# EAGLE design emonDCduo-ESP v1.0a (EAGLE 7.7.0)
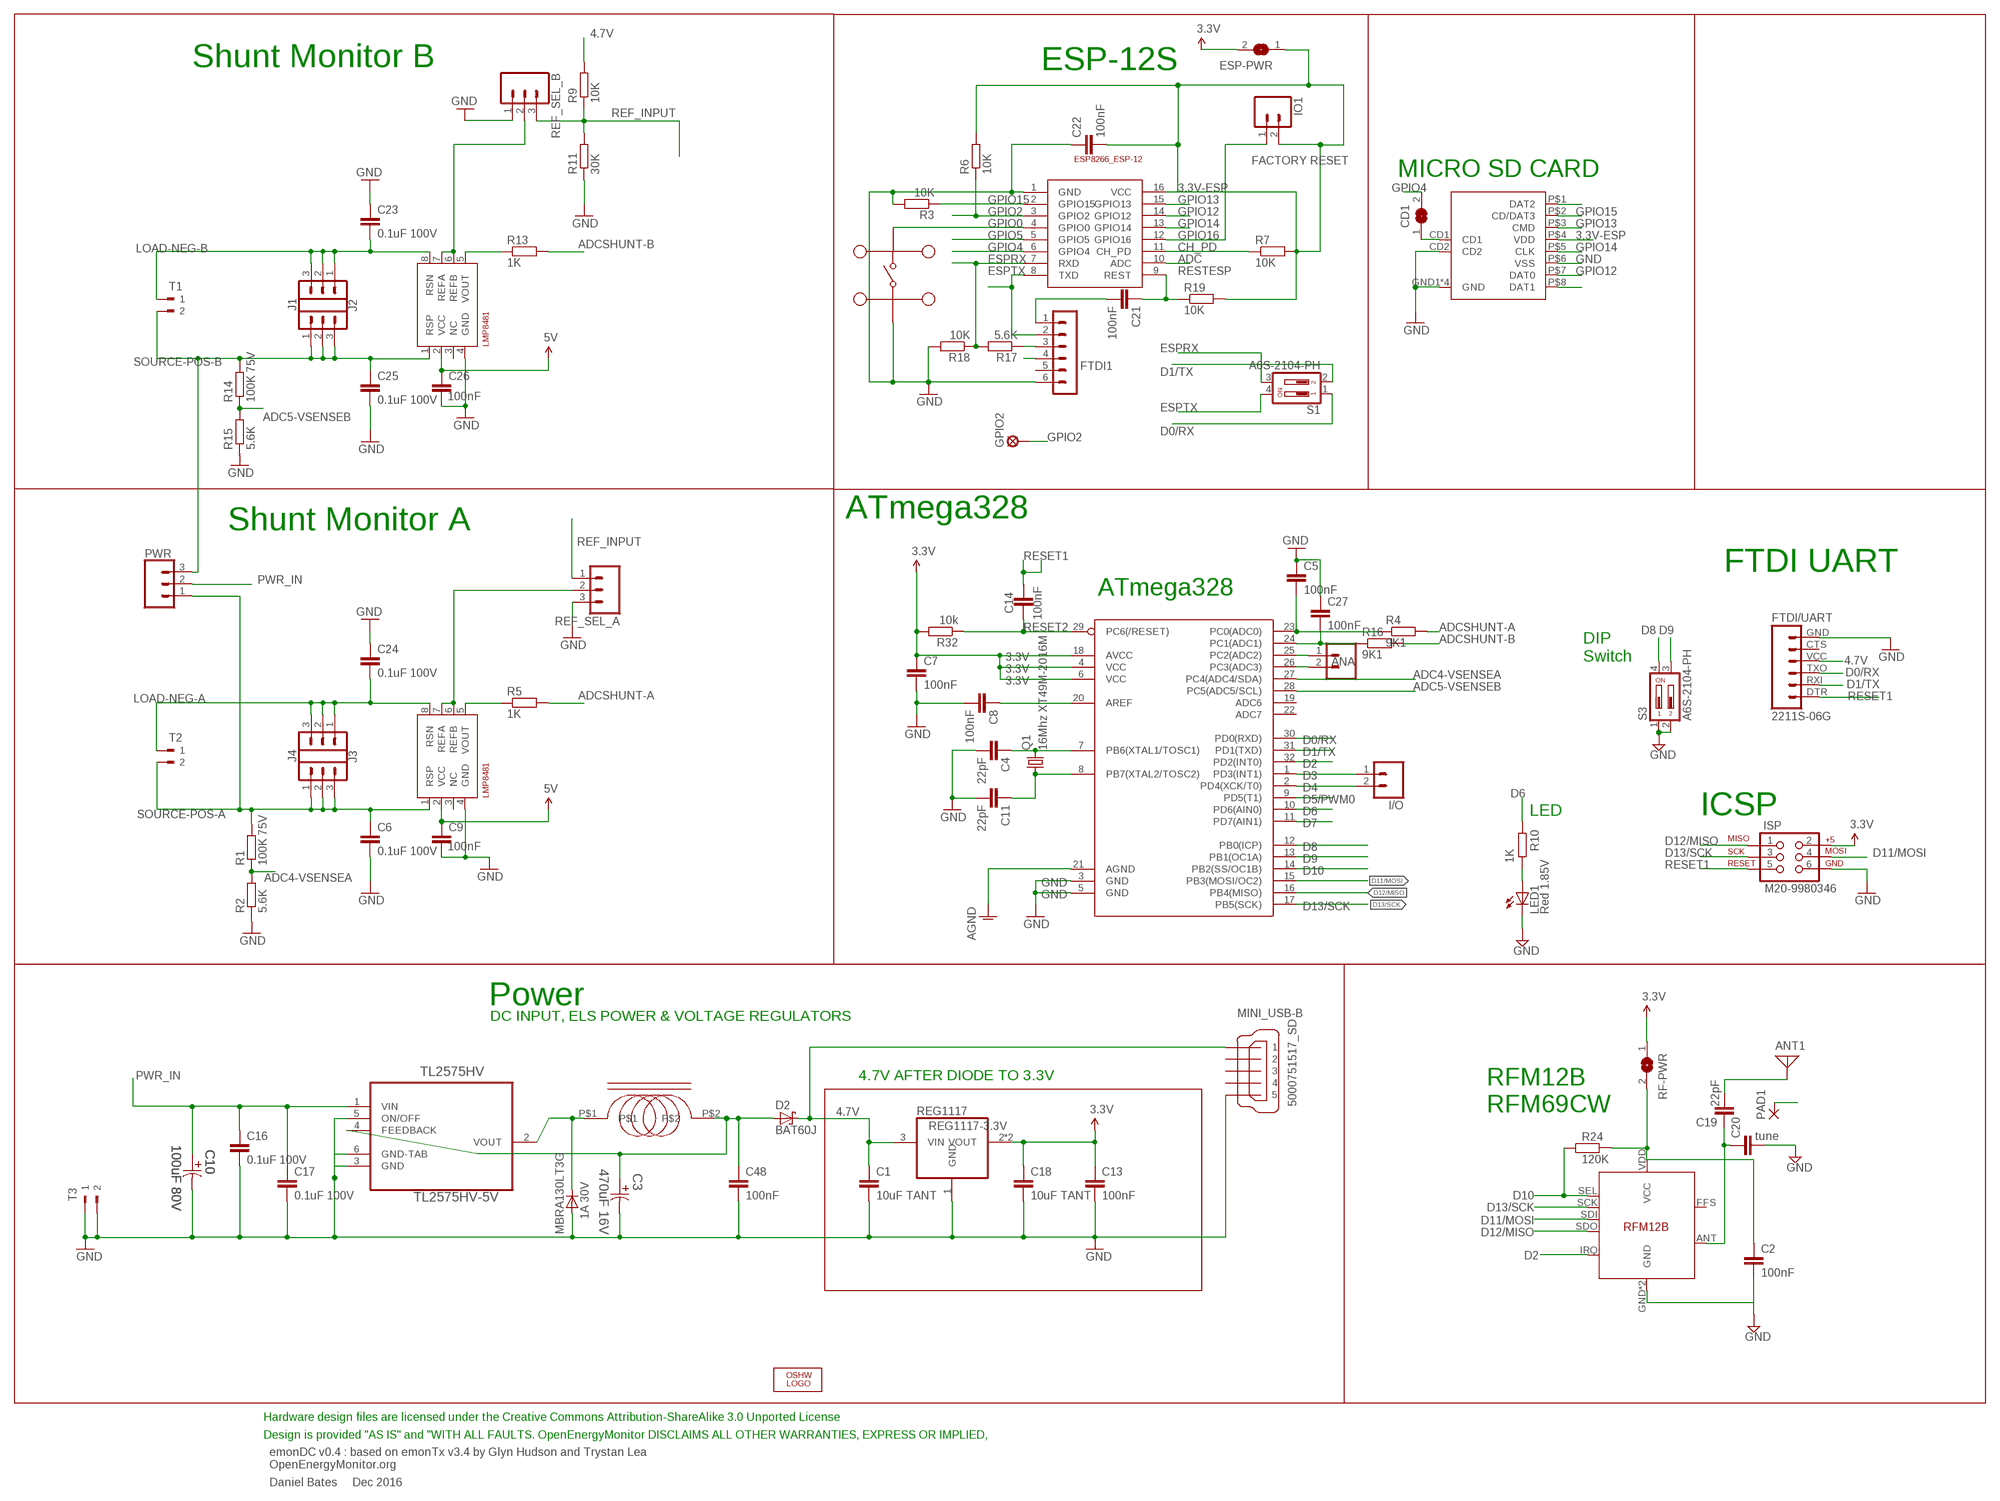
[diagram p0: schematic, sheet 1]

## Parts
ANA  2212S-02SG-85  M02LOCK  [1X02_LOCK]
ANT1  ANTENNA  [PAD-01]
C1  10uF TANT  C-EUC0603  [C0603]
C2  100nF  C-EUC0603  [C0603]
C3  470uF 16V  EEE-FK1C471P-CASE-F  [CAPAE830X1050N]
C4  22pF  C-EUC0603  [C0603]
C5  100nF  C-EUC0603  [C0603]
C6  0.1uF 100V  C-EUC0603  [C0603]
C7  100nF  C-EUC0603  [C0603]
C8  100nF  C-EUC0603  [C0603]
C9  100nF  C-EUC0603  [C0603]
C10  100uF 80V  EEV-FK1K101Q-CASE-H13  [CAPAE1350X1400N]
C11  22pF  C-EUC0603  [C0603]
C13  100nF  C-EUC0603  [C0603]
C14  100nF  C-EUC0603  [C0603]
C16  0.1uF 100V  C-EUC0603  [C0603]
C17  0.1uF 100V  C-EUC0603  [C0603]
C18  10uF TANT  C-EUC0603  [C0603]
C19  22pF  C-EUC0603  [C0603]
C20  tune  C-EUC0603  [C0603]
C21  100nF  C-EUC0603  [C0603]
C22  100nF  C-EUC0603  [C0603]
C23  0.1uF 100V  C-EUC0603  [C0603]
C24  0.1uF 100V  C-EUC0603  [C0603]
C25  0.1uF 100V  C-EUC0603  [C0603]
C26  100nF  C-EUC0603  [C0603]
C27  100nF  C-EUC0603  [C0603]
C48  100nF  C-EUC0603  [C0603]
CD1  SJ  [SJ]
D1  MBRA130LT3G  [DO-214]
D2  BAT60J  [SOD323_ST]
ESP-12  ESP8266_ESP-12  [ESP8266-ESP12]
ESP-PWR  SJ  [SJ]
FTDI1  FTDI-ESP  MA06-1  [MA06-1]
FTDI/UART  2211S-06G  FTDI_BASICPTH  [FTDI_BASIC]
GPIO2  LSP11  [LSP11]
I1  330uH  SRR0603-331KL  [SRR0603-331KL]
I/O  2212S-02SG-85  M02LOCK  [1X02_LOCK]
IO1  M02PTH  [1X02]
ISP  M20-9980346  AVR_SPI_PRG_6PTH  [2X3]
J1  CONN_03  [1X03]
J2  CONN_03  [1X03]
J3  CONN_03  [1X03]
J4  CONN_03  [1X03]
LED1  Red 1.85V  LEDCHIP-LED0805  [CHIP-LED0805]
LOGO1  OSHW_LOGO_6MILX0200-NT  [OSHW_6X200_NOTEXT]
MC2  MC32882  [SWITCH_TACT_MULTICOMP]
MINI_USB-B  5000751517_SD  [5000751517_SD]
PAD1  SMD2  [SMD1,27-2,54]
PWR  CONN_03  [1X03]
Q1  16Mhz XT49M-2016M  CRYSTALHC49UP  [HC49UP]
R1  100K 75V  R-EU_R0603  [R0603]
R2  5.6K  R-EU_R0603  [R0603]
R3  10K  R-EU_R0603  [R0603]
R4  9K1  R-EU_R0603  [R0603]
R5  1K  R-EU_R0603  [R0603]
R6  10K  R-EU_R0603  [R0603]
R7  10K  R-EU_R0603  [R0603]
R9  10K  R-EU_R0603  [R0603]
R10  1K  R-EU_R0603  [R0603]
R11  30K  R-EU_R0603  [R0603]
R13  1K  R-EU_R0603  [R0603]
R14  100K 75V  R-EU_R0603  [R0603]
R15  5.6K  R-EU_R0603  [R0603]
R16  9K1  R-EU_R0603  [R0603]
R17  5.6K  R-EU_R0603  [R0603]
R18  10K  R-EU_R0603  [R0603]
R19  10K  R-EU_R0603  [R0603]
R24  120K  R-EU_R0603  [R0603]
R32  10k  R-EU_R0603  [R0603]
REF_SEL_A  2212S-02SG-85  CONN_03  [1X03]
REF_SEL_B  2212S-02SG-85  CONN_03  [1X03]
REG1117  REG1117-3.3V  REG1117-VOUT4  [SOT223]
RF  RFM12B  [RFM12B]
RF-PWR  SJ  [SJ]
S1  A6S-2104-PH  2_SMT_DIP_SWITCH  [DIP_SWITCH_SMT]
S3  A6S-2104-PH  2_SMT_DIP_SWITCH  [DIP_SWITCH_SMT]
SHUNTMON-A  LMP8481  LMP8481-H  [S-PDSO-G08]
SHUNTMON-B  LMP8481  LMP8481-H  [S-PDSO-G08]
T1  180-2  [180-2]
T2  180-2  [180-2]
T3  180-2  [180-2]
TL2575HV  TL2575HV-5V  TL2575HV-05IKTTR  [TO-263]
U1_TQFP  ATMEGA328P  ATMEGA328_SMT  [TQFP32-08]
U$2  MOLEX_MICRO_SD_1040310811  [MOLEX_MICROSD_EXPOSED]

## Nets
3.3V: C7.1 C13.1 C18.1 ESP-PWR.2 ISP.2 R32.2 REG1117.2(VOUT) REG1117.4(VOUT) RF-PWR.1 U1_TQFP.4(VCC) U1_TQFP.6(VCC) U1_TQFP.18(AVCC)
3.3V-ESP: C22.2 ESP-12.16(VCC) ESP-PWR.1 IO1.2 R6.2 R7.2 R19.2 U$2.P$4(VDD)
3.3V-RF: C2.1 R24.2 RF-PWR.2 RF.VDD(VCC)
4.7V [power]: C1.1 C9.1 C26.1 D2.C FTDI1.4 FTDI/UART.VCC MINI_USB-B.VBUS R9.2 REG1117.3(VIN) SHUNTMON-A.2(VCC) SHUNTMON-B.2(VCC) ; supply symbol labelled 5V
5.0V [power]: C3.1 C48.1 D2.A I1.P$2 TL2575HV.4(FEEDBACK)
ADC: ESP-12.10(ADC)
ADC0: C5.2 R4.1 U1_TQFP.23(PC0(ADC0))
ADC1: C27.2 R16.1 U1_TQFP.24(PC1(ADC1))
ADC2: ANA.1 U1_TQFP.25(PC2(ADC2))
ADC3: ANA.2 U1_TQFP.26(PC3(ADC3))
ADC4-VSENSEA: R1.1 R2.2 U1_TQFP.27(PC4(ADC4/SDA))
ADC5-VSENSEB: R14.1 R15.2 U1_TQFP.28(PC5(ADC5/SCL))
ADCSHUNT-A: R4.2 R5.2
ADCSHUNT-B: R13.2 R16.2
AGND [thin_power]: U1_TQFP.21(AGND)
CH_PD: ESP-12.11(CH_PD) R7.1
D0/RX: FTDI/UART.TXO S1.1 U1_TQFP.30(PD0(RXD))
D1/TX: FTDI/UART.RXI S1.2 U1_TQFP.31(PD1(TXD))
D2: RF.IRQ U1_TQFP.32(PD2(INT0))
D3: I/O.1 U1_TQFP.1(PD3(INT1))
D4: I/O.2 U1_TQFP.2(PD4(XCK/T0))
D5/PWM0: U1_TQFP.9(PD5(T1))
D6: R10.2 U1_TQFP.10(PD6(AIN0))
D7: U1_TQFP.11(PD7(AIN1))
D8: S3.4 U1_TQFP.12(PB0(ICP))
D9: S3.3 U1_TQFP.13(PB1(OC1A))
D10: R24.1 RF.SEL U1_TQFP.14(PB2(SS/OC1B))
D11/MOSI: ISP.4 RF.SDI U1_TQFP.15(PB3(MOSI/OC2))
D12/MISO: ISP.1 RF.SDO U1_TQFP.16(PB4(MISO))
D13/SCK: ISP.3 RF.SCK U1_TQFP.17(PB5(SCK))
DIG1: C19.1 C20.1 RF.ANT
ESPRX: ESP-12.7(RXD) R17.2 R18.1 S1.3
ESPTX: ESP-12.8(TXD) FTDI1.2 S1.4
GND [thin_power]: C1.2 C2.2 C3.2 C4.2 C5.1 C6.2 C7.2 C8.2 C9.2 C10.2 C11.2 C13.2 C16.2 C17.2 C18.2 C20.2 C22.1 C23.1 C24.1 C25.2 C26.2 C27.1 C48.2 D1.P$2(A) ESP-12.1(GND) FTDI1.6 FTDI/UART.GND ISP.6 LED1.C MC2.P$1 MC2.P$2 MINI_USB-B.GND1 MINI_USB-B.GND2 MINI_USB-B.GND3 R2.1 R3.2 R11.1 R15.1 R18.2 REF_SEL_A.3 REF_SEL_B.1 REG1117.1(GND) RF.GND RF.P$12(GND) S3.1 S3.2 SHUNTMON-A.4(GND) SHUNTMON-B.4(GND) T3.1 T3.2 TL2575HV.3(GND) TL2575HV.5(ON/OFF) TL2575HV.6(GND-TAB) U1_TQFP.3(GND) U1_TQFP.5(GND) U$2.CD2 U$2.GND1(GND) U$2.GND2(GND) U$2.GND3(GND) U$2.GND4(GND) U$2.P$6(VSS)
GPIO0: ESP-12.4(GPIO0) MC2.P$3 MC2.P$4
GPIO2: ESP-12.3(GPIO2) GPIO2.MP R6.1
GPIO4: CD1.2 ESP-12.6(GPIO4)
GPIO5: ESP-12.5(GPIO5)
GPIO12: ESP-12.14(GPIO12) U$2.P$7(DAT0)
GPIO13: ESP-12.15(GPIO13) U$2.P$3(CMD)
GPIO14: ESP-12.13(GPIO14) U$2.P$5(CLK)
GPIO15 [thin_power]: ESP-12.2(GPIO15) R3.1 U$2.P$2(CD/DAT3)
GPIO16: ESP-12.12(GPIO16) IO1.1
IND: D1.P$1(C) I1.P$1 TL2575HV.2(VOUT)
LOAD-NEG-A: C24.2 J4.1 J4.2 J4.3 SHUNTMON-B.8(RSN) T2.1
LOAD-NEG-B: C23.2 J1.1 J1.2 J1.3 SHUNTMON-A.8(RSN) T1.1
N$1: C4.1 Q1.2 U1_TQFP.7(PB6(XTAL1/TOSC1))
N$3: ANT1.1 C19.2
N$4: R13.1 SHUNTMON-A.5(VOUT)
N$5: PAD1.1(P)
N$6: R5.1 SHUNTMON-B.5(VOUT)
N$7: U$2.P$1(DAT2)
N$9: C11.1 Q1.1 U1_TQFP.8(PB7(XTAL2/TOSC2))
N$10: CD1.1 U$2.CD1
N$20: C8.1 U1_TQFP.20(AREF)
N$30: C21.2 FTDI1.1
N$32: U$2.P$8(DAT1)
N$36: FTDI1.3 R17.1
N$41: LED1.A R10.1
PWR_IN: C10.1 C16.1 C17.1 PWR.2 TL2575HV.1(VIN)
REF_A_INPUT [thin_power]: REF_SEL_A.2 SHUNTMON-B.6(REFB) SHUNTMON-B.7(REFA)
REF_B_INPUT: REF_SEL_B.2 SHUNTMON-A.6(REFB) SHUNTMON-A.7(REFA)
REF_INPUT: R9.1 R11.2 REF_SEL_A.1 REF_SEL_B.3
RESET1: C14.2 FTDI/UART.DTR ISP.5
RESET2: C14.1 R32.1 U1_TQFP.29(PC6(/RESET))
RESTESP: C21.1 ESP-12.9(REST) R19.1
SOURCE-POS-A: C6.1 J3.1 J3.2 J3.3 PWR.1 R1.2 SHUNTMON-B.1(RSP) T2.2
SOURCE-POS-B: C25.1 J2.1 J2.2 J2.3 PWR.3 R14.2 SHUNTMON-A.1(RSP) T1.2
Unconnected: FTDI1.5 FTDI/UART.CTS MINI_USB-B.D+ MINI_USB-B.D- MINI_USB-B.ID RF.FFS SHUNTMON-A.3(NC) SHUNTMON-B.3(NC) U1_TQFP.19(ADC6) U1_TQFP.22(ADC7)

## Notes on the sheet
- Shunt Monitor B | ESP-12S
- FACTORY RESET
- MICRO SD CARD
- ATmega328
- Shunt Monitor A
- FTDI UART
- ATmega328
- DIP
  Switch
- LED | ICSP
- Power
- DC INPUT, ELS POWER & VOLTAGE REGULATORS
- 4.7V AFTER DIODE TO 3.3V
- RFM12B
  RFM69CW
- Hardware design files are licensed under the Creative Commons Attribution-ShareAlike 3.0 Unported License
- Design is provided "AS IS" and "WITH ALL FAULTS. OpenEnergyMonitor DISCLAIMS ALL OTHER WARRANTIES, EXPRESS OR IMPLIED,
- emonDC v0.4 : based on emonTx v3.4 by Glyn Hudson and Trystan Lea
  OpenEnergyMonitor.org
- Daniel Bates     Dec 2016

## Library data of the parts
ANA I/O = SparkFun-Connectors:M02: Standard 2-pin 0.1" header. Use with - straight break away headers ( PRT-00116) - right angle break away headers (PRT-00553) - swiss pins (PRT-00743) - machine pins (PRT-00117) - female headers (PRT-00115) Molex polarized connector foot print use with: PRT-08233 with associated crimp pins and housings. 2.54_SCREWTERM for use with PRT-10571. 3.5mm Screw Terminal footprints for PRT-08084 5mm Screw Terminal footprints for use with PRT-08432; MF: MULTICOMP; MPN: 2212S-02SG-85; OC_FARNELL: 1593458
ANT1 = discrete:ANTENNA: Antenna; OC_FARNELL: unknown
C1 C2 C4 C5 C7 C8 C11 C13 C14 C16-C22 C27 C48 = rcl:C-EU: CAPACITOR, European symbol
C3 = Panasonic-EEEFK_EEEFP:EEE-: Aluminum Electrolytic Capacitors,Surface Mount Type; MPN: EEE-FK1C471P; OC_FARNELL: 9695710; OC_NEWARK: 96K9385; PACKAGE: CASE-F; SUPPLIER: PANASONIC; TOLERANCE: ±20 %; VALUE: 470UF; VOLTAGERATING: 16V
C6 C9 C23-C26 = rcl:C-EU: CAPACITOR, European symbol; MPN: C1608X7S2A104K080AB
C10 = Panasonic-EEE-EEV-EEF-ECQ:EEV-: Aluminum Electrolytic Capacitors,Surface Mount Type; MPN: EEVFK1K101Q; OC_FARNELL: 9696113; OC_NEWARK: 96K9484; SUPPLIER: PANASONIC; TOLERANCE: ±20 %; VALUE: 100UF; VOLTAGERATING: 80V
CD1 ESP-PWR RF-PWR = jumper:SJ: SMD solder JUMPER
D1 = CASE 403D Diode:MBRA130LT3G: Fast switching diode; MF: ON SEMICONDUCTOR; MPN: MBRA130LT3G; OC_FARNELL: 9555978
D2 = diode:BAT60J: Schottky barrier diode Source: www.st.com, BAT60J.pdf
ESP-12 = ESP8266-ESP12:ESP8266_ESP-12
FTDI1 = JeeLabs:MA06-1: PIN HEADER
FTDI/UART = SparkFun:FTDI_BASIC: FTDI Basic: 3.3V and 5V; MF: MULTICOMP; MPN: 2211S-06G; OC_FARNELL: 1593415
GPIO2 = solpad:LSP11: SOLDER PAD drill 1.1 mm
I1 = SRR0603-331KL:SRR0603-331KL: SRR0603-331KL; INDUCTANCE: 330uH; MF: BOURNS; MPN: SRR0603-331KL; OC_FARNELL: 2333890
IO1 = SparkFun:M02: Header 2 Standard 2-pin 0.1" header. Use with straight break away headers (SKU : PRT-00116), right angle break away headers (PRT-00553), swiss pins (PRT-00743), machine pins (PRT-00117), and female headers (PRT-00115). Molex polarized connector foot print use with SKU : PRT-08233 with associated crimp pins and housings.
ISP = SparkFun:AVR_SPI_PRG_6: AVR ISP 6 Pin This is the reduced ISP connector for AVR programming. Common on Arduino. This footprint will take up less PCB space and can be used with a 10-pin to 6-pin adapter such as SKU: BOB-08508; MF: HARWIN; MPN: M20-9980346; OC_FARNELL: 1022231
J1-J4 PWR = SparkFun-Connectors:CONN_03: Multi connection point. Often used as Generic Header-pin footprint for 0.1 inch spaced/style header connections On any of the 0.1 inch spaced packages, you can populate with these: Break Away Headers - Straight <https://www.sparkfun.com/products/116> (PRT-00116) Break Away Male Headers - Right Angle <https://www.sparkfun.com/products/553> (PRT-00553) Female Headers <https://www.sparkfun.com/products/115> (PRT-00115) Break Away Headers - Machine Pin <https://www.sparkfun.com/products/117> (PRT-00117) Break Away Female Headers - Swiss Machine Pin <https://www.sparkfun.com/products/743> (PRT-00743) Stackable Header - 3 Pin (Female, 0.1") <https://www.sparkfun.com/products/13875> (PRT-13875) For SCREWTERMINALS and SPRING TERMINALS visit here: Screw Terimnals on SparkFun.com <https://www.sparkfun.com/search/results?term=Screw+Terminals> (5mm/3.5mm/2.54mm spacing) This device is also useful as a general connection point to wire up your design to another part of your project. Our various solder wires solder well into these plated through hole pads. Hook-Up Wire - Assortment (Stranded, 22 AWG) <https://www.sparkfun.com/products/11375> (PRT-11375) Hook-Up Wire - Assortment (Solid Core, 22 AWG) <https://www.sparkfun.com/products/11367> (PRT-11367) View the entire wire category on our website here <https://www.sparkfun.com/categories/141> Special notes: Molex polarized connector foot print use with SKU : PRT-08232 with associated crimp pins and housings.
LED1 = adafruit:LED: LED OSRAM: - CHIPLED LG R971, LG N971, LY N971, LG Q971, LY Q971, LO R971, LY R971 LH N974, LH R974 LS Q976, LO Q976, LY Q976 LO Q996 - Hyper CHIPLED LW Q18S LB Q993, LB Q99A, LB R99A - SideLED LS A670, LO A670, LY A670, LG A670, LP A670 LB A673, LV A673, LT A673, LW A673 LH A674 LY A675 LS A676, LA A676, LO A676, LY A676, LW A676 LS A679, LY A679, LG A679 - Hyper Micro SIDELED® LS Y876, LA Y876, LO Y876, LY Y876 LT Y87S - SmartLED LW L88C, LW L88S LB L89C, LB L89S, LG L890 LS L89K, LO L89K, LY L89K LS L896, LA L896, LO L896, LY L896 - TOPLED LS T670, LO T670, LY T670, LG T670, LP T670 LSG T670, LSP T670, LSY T670, LOP T670, LYG T670 LG T671, LOG T671, LSG T671 LB T673, LV T673, LT T673, LW T673 LH T674 LS T676, LA T676, LO T676, LY T676, LB T676, LH T676, LSB T676, LW T676 LB T67C, LV T67C, LT T67C, LS T67K, LO T67K, LY T67K, LW E67C LS E67B, LA E67B, LO E67B, LY E67B, LB E67C, LV E67C, LT E67C LW T67C LS T679, LY T679, LG T679 LS T770, LO T770, LY T770, LG T770, LP T770 LB T773, LV T773, LT T773, LW T773 LH T774 LS E675, LA E675, LY E675, LS T675 LS T776, LA T776, LO T776, LY T776, LB T776 LHGB T686 LT T68C, LB T68C - Hyper Mini TOPLED® LB M676 - Mini TOPLED Santana® LG M470 LS M47K, LO M47K, LY M47K Source: http://www.osram.convergy.de/; MF: ROHM; MPN: SML-211UTT86K; OC_FARNELL: 1685056
LOGO1 = ohw-logo:OSHW_LOGO_6MIL; OC_FARNELL: unknown
MC2 = multicomp tact switch:MC32882
MINI_USB-B = 5000751517_sd:5000751517_SD
PAD1 = wirepad:SMD2: SMD PAD
Q1 = adafruit:CRYSTAL: CRYSTAL; MF: VISHAY; MPN: XT49M-2016M; OC_FARNELL: 1469641; OC_NEWARK: unknown
R1 R14 = rcl:R-EU_: RESISTOR, European symbol; MPN: MCWR06X1003FTL
R2 R15 = rcl:R-EU_: RESISTOR, European symbol; MPN: MCWR06X5901FTL
R3-R7 R9-R11 R13 R16-R19 R24 R32 = rcl:R-EU_: RESISTOR, European symbol
REF_SEL_A REF_SEL_B = SparkFun-Connectors:CONN_03: Multi connection point. Often used as Generic Header-pin footprint for 0.1 inch spaced/style header connections On any of the 0.1 inch spaced packages, you can populate with these: Break Away Headers - Straight <https://www.sparkfun.com/products/116> (PRT-00116) Break Away Male Headers - Right Angle <https://www.sparkfun.com/products/553> (PRT-00553) Female Headers <https://www.sparkfun.com/products/115> (PRT-00115) Break Away Headers - Machine Pin <https://www.sparkfun.com/products/117> (PRT-00117) Break Away Female Headers - Swiss Machine Pin <https://www.sparkfun.com/products/743> (PRT-00743) Stackable Header - 3 Pin (Female, 0.1") <https://www.sparkfun.com/products/13875> (PRT-13875) For SCREWTERMINALS and SPRING TERMINALS visit here: Screw Terimnals on SparkFun.com <https://www.sparkfun.com/search/results?term=Screw+Terminals> (5mm/3.5mm/2.54mm spacing) This device is also useful as a general connection point to wire up your design to another part of your project. Our various solder wires solder well into these plated through hole pads. Hook-Up Wire - Assortment (Stranded, 22 AWG) <https://www.sparkfun.com/products/11375> (PRT-11375) Hook-Up Wire - Assortment (Solid Core, 22 AWG) <https://www.sparkfun.com/products/11367> (PRT-11367) View the entire wire category on our website here <https://www.sparkfun.com/categories/141> Special notes: Molex polarized connector foot print use with SKU : PRT-08232 with associated crimp pins and housings.; MF: MULTICOMP; MPN: 2212S-02SG-85; OC_FARNELL: 1593458
REG1117 = burr-brown:REG1117-VOUT4: 800mA and 1A Low Dropout (LDO) Positive Regulator 1.8V, 2.5V, 2.85V, 3.3V, 5V, and Adj; MF: TEXAS INSTRUMENTS; MPN: REG1117; OC_FARNELL: 1097566; OC_NEWARK: 14P6981
RF = JeeParts:RFM12B; OC_FARNELL: unknown
S1 S3 = OpenEnergyMonitor:2_SMT_DIP_SWITCH: Multicomp MCEMR-02-T 2 throw SMT DIP switch, Farnell 1524005; MF: OMRON ELECTRONIC COMPONENTS; MPN: A6S2104H; OC_FARNELL: 1960894
SHUNTMON-A = lmp8481b:LMP8481: LMP8481MM-H/NOPB 100V/V; MF: TEXAS INSTRUMENTS; MPN: LMP8481MME-S/NOPB; OC_FARNELL: 2322044
SHUNTMON-B = lmp8481b:LMP8481: LMP8481MM-H/NOPB 100V/V; MF: TEXAS INSTRUMENTS; MPN: LMP8481MME-H/NOPB; OC_FARNELL: 2322044
T1-T3 = con-weidmueller-sl35:180-2: WEIDMUELLER CLAMP CONNECTOR; OC_FARNELL: unknown; OC_NEWARK: unknown
TL2575HV = TL2575HV:TL2575HV; MF: TEXAS INSTRUMENTS; MPN: LM2575HVS-15/NOPB; OC_FARNELL: 2492609
U1_TQFP = SparkFun-DigitalIC:ATMEGA328_SMT: 32-Pin Atmega328 part Commonly used on Arduino compatible boards Available in QFP and QFN packages TQFP is IC-09069 QFN is non-stock; MF: ATMEL; MPN: ATMEGA328P-AU; OC_FARNELL: 1972086; PROD_ID: IC-09069
U$2 = MOLEX MICRO SD [exposed pins]:MOLEX_MICRO_SD_1040310811

## Net classes
2 thin_power: width 0.254 mm

## Board
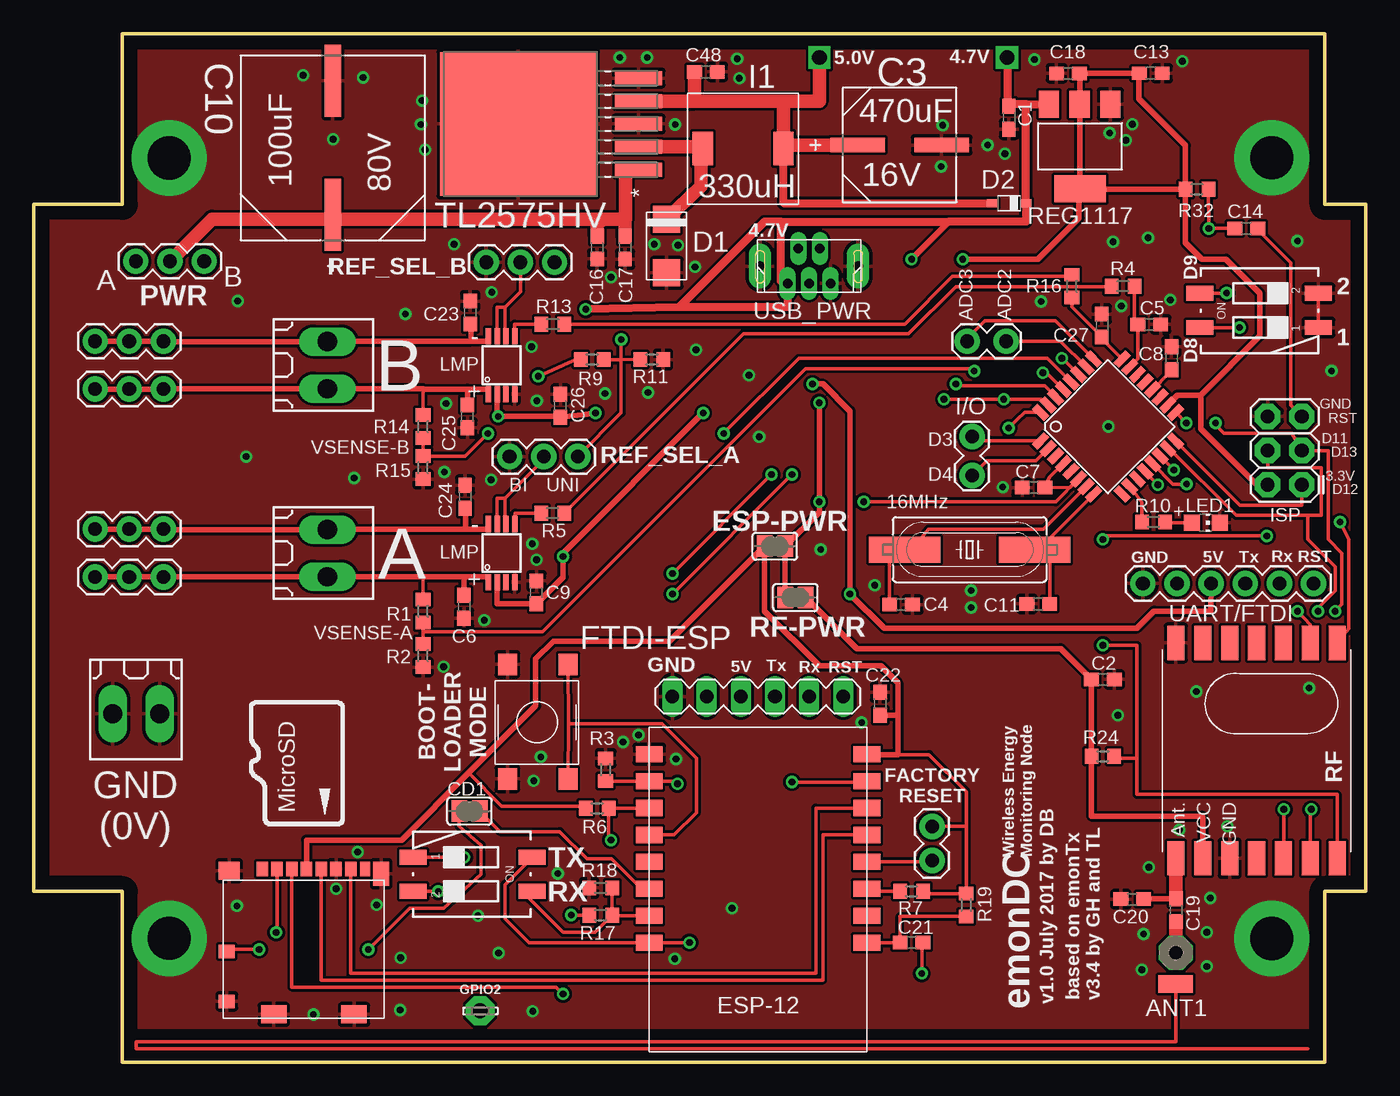
[diagram p1: board, top side]
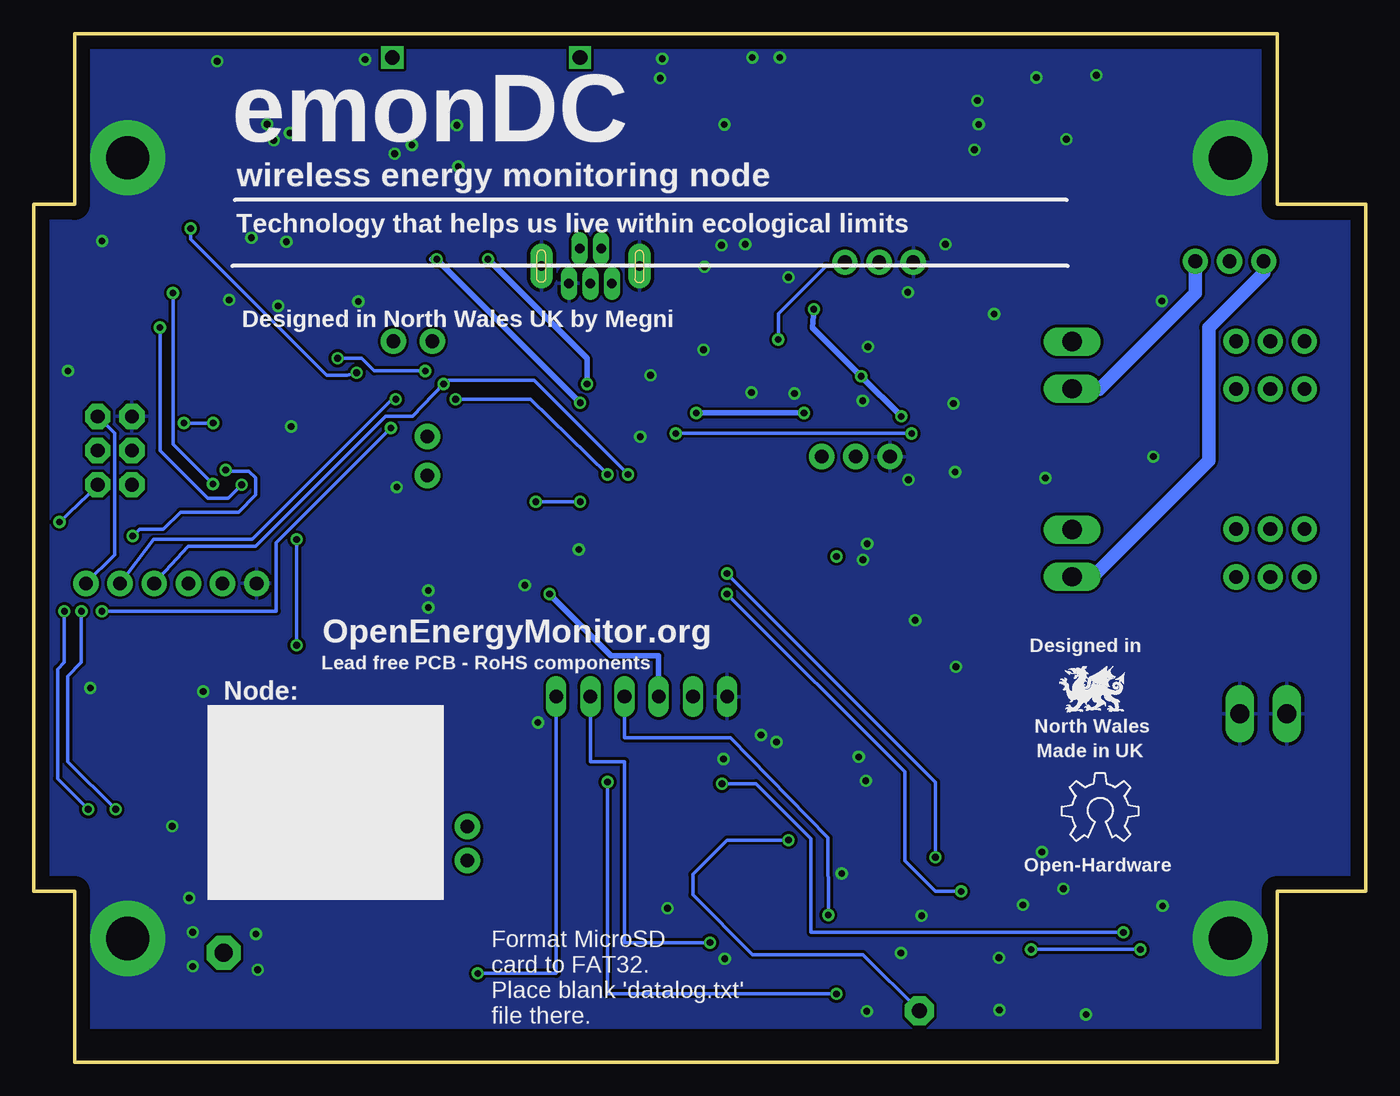
[diagram p2: board, bottom side, seen from below]

Size 99.06 x 76.45 mm. Coordinates in mm from the lower left corner, seen from the top.
Outline: 6.6,63.75 6.6,76.45 96.01,76.45 96.01,63.75 99.06,63.75 99.06,12.7 96.01,12.7 96.01,0 6.6,0 6.6,12.7 0,12.7 0,63.75 6.6,63.75
Copper layers (1*16): Top 0.035mm / dielectric 1.5mm / Bottom 0.035mm
Design rules "default *": minimum track width 10mil, minimum drill 19mil, track to track 8mil, track to pad 8mil, pad to pad 8mil, via to via 8mil, smd to smd 8mil, copper to edge 40mil, drill to drill 8mil, minimum pad ring 10mil, minimum via ring 8mil, stop-mask expansion 4mil, vias tented up to drill 0mil, thermal gap 10mil

### Footprints (pad centres in the part's own frame; a part is rotated, then mirrored left to right if it is on the bottom)
1X02_LOCK = drill 1.016 pad 1.88: 1 -0.178,0; 2 2.718,0
PAD-01 = drill 1.321 pad 2.54 octagon: 1 0,0
C0603 = smd 1.1 x 1: 1 -0.85,0; 2 0.85,0
CAPAE830X1050N = smd 4.064 x 1.092: 1 -3.124,0; 2 3.124,0
CAPAE1350X1400N = smd 5.359 x 1.194: 1 -4.978,0; 2 4.978,0
SJ = smd 1.168 x 1.6: 1 -0.762,0; 2 0.762,0
DO-214 = smd 2 x 2: P$1 -2,0; P$2 2,0
SOD323_ST = smd 0.8 x 0.6: A 1.25,0; C -1.25,0
ESP8266-ESP12 = smd 2 x 1.2: 1 16.2,2; 2 16.2,4; 3 16.2,6; 4 16.2,8; 5 16.2,10; 6 16.2,12; 7 16.2,14; 8 16.2,16; 9 0,16; 10 0,14; 11 0,12; 12 0,10; 13 0,8; 14 0,6; 15 0,4; 16 0,2
MA06-1 = drill 1.016 long: 1 0,0; 2 2.54,0; 3 5.08,0; 4 7.62,0; 5 10.16,0; 6 12.7,0
FTDI_BASIC = drill 1.016 pad 1.88: CTS 10.16,0; DTR 0,0; GND 12.7,0; RXI 2.54,0; TXO 5.08,0; VCC 7.62,0
LSP11 = drill 1.118 pad 2.159 octagon: MP 0,0
SRR0603-331KL = smd 1.5 x 2.5: P$1 -3,0; P$2 3,0
1X02 = drill 1.016 pad 1.88: 1 0,0; 2 2.54,0
2X3 = drill 1.016 pad 1.88 octagon: 1 0,0; 2 0,2.54; 3 2.54,0; 4 2.54,2.54; 5 5.08,0; 6 5.08,2.54
1X03 = drill 1.016 pad 1.88: 1 0,0; 2 2.54,0; 3 5.08,0
CHIP-LED0805 = smd 1.2 x 1.2: A 0,-1.05; C 0,1.05
SWITCH_TACT_MULTICOMP = smd 1.6 x 1.4: P$1 -1.1,5.3; P$2 7.4,5.3; P$3 -1.1,0.8; P$4 7.4,0.8
5000751517_SD = drill 0.7 pad 1.016 long: D+ 0,-1.3; D- -0.8,1.3; GND1 1.6,-1.3; ID 0.8,1.3; VBUS -1.6,-1.3 | drill 0.7 pad 1.676 long: GND2 3.65,0; GND3 -3.65,0
SMD1,27-2,54 = smd 1.27 x 2.54: 1 0,0
HC49UP = smd 5.334 x 1.93: 1 -4.826,0; 2 4.826,0
R0603 = smd 1 x 1.1: 1 -0.85,0; 2 0.85,0
SOT223 = smd 1.499 x 2.007: 1 -2.261,-3.15; 2 0.025,-3.15; 3 2.311,-3.15 | smd 3.81 x 2.007: 4 0,3.15
RFM12B = smd 2.54 x 1.27: ANT 8,-6; FFS -8,2; GND 8,-2; IRQ -8,4; P$8 -8,0; P$9 -8,-2; P$10 -8,-4; P$12 -8,-6; P$16 8,0; SCK 8,4; SDI 8,2; SDO -8,6; SEL 8,6; VDD 8,-4
DIP_SWITCH_SMT = smd 1.1 x 2: 1 -1.27,-4.215; 2 1.27,-4.215; 3 1.27,4.615; 4 -1.27,4.615
S-PDSO-G08 = smd 0.4 x 1.2: 1 -0.975,-2.157; 2 -0.325,-2.157; 3 0.325,-2.157; 4 0.975,-2.157; 5 0.975,2.157; 6 0.325,2.157; 7 -0.325,2.157; 8 -0.975,2.157
180-2 = drill 1.422 long: 1 -1.75,0; 2 1.75,0
TO-263 = smd 1.041 x 3.505: 1 -3.404,-8.788; 2 -1.702,-8.788; 3 0,-8.788; 4 1.702,-8.788; 5 3.404,-8.788 | smd 10.668 x 11.659: 6 0,0.152
TQFP32-08 = smd 1.27 x 0.559: 1 -4.293,2.8; 2 -4.293,2; 3 -4.293,1.2; 4 -4.293,0.4; 5 -4.293,-0.4; 6 -4.293,-1.2; 7 -4.293,-2; 8 -4.293,-2.8; 17 4.293,-2.8; 18 4.293,-2; 19 4.293,-1.2; 20 4.293,-0.4; 21 4.293,0.4; 22 4.293,1.2; 23 4.293,2; 24 4.293,2.8 | smd 0.559 x 1.27: 9 -2.8,-4.293; 10 -2,-4.293; 11 -1.2,-4.293; 12 -0.4,-4.293; 13 0.4,-4.293; 14 1.2,-4.293; 15 2,-4.293; 16 2.8,-4.293; 25 2.8,4.293; 26 2,4.293; 27 1.2,4.293; 28 0.4,4.293; 29 -0.4,4.293; 30 -1.2,4.293; 31 -2,4.293; 32 -2.8,4.293
MOLEX_MICROSD_EXPOSED = smd 1.195 x 1.005: CD1 5.349,0.435; CD2 5.349,4.135 | smd 1.907 x 1.348: GND1 -4.112,5.104; GND2 1.853,5.104 | smd 1.17 x 1.793: GND3 -6.134,-5.352 | smd 1.551 x 1.348: GND4 5.167,-5.577 | smd 0.851 x 1.092: P$1 2.707,-5.703; P$2 1.617,-5.703; P$3 0.522,-5.699; P$4 -0.586,-5.701; P$5 -1.676,-5.703; P$6 -2.769,-5.703; P$7 -3.875,-5.701 | smd 0.749 x 1.092: P$8 -4.935,-5.701

### Placement (x,y rotation side)
ANA  69.6,53.59 0 top
ANT1  84.94,8.13 0 top
C1  72.52,70.21 270 top
C2  79.5,28.45 0 top
C3  64.39,68.17 0 top
C4  64.5,34.01 0 top
C5  82.95,54.84 180 top
C6  32,33.86 270 top
C7  74.35,42.71 180 top
C8  84.61,52.32 90 top
C9  37.39,34.93 90 top
C10  22.25,67.96 90 top
C11  74.7,34.07 180 top
C13  83.06,73.51 0 top
C14  90.17,61.98 0 top
C16  41.9,60.55 270 top
C17  43.97,60.55 270 top
C18  76.91,73.51 180 top
C19  84.94,11.3 270 top
C20  81.69,12.12 180 top
C21  65.28,8.89 0 top
C22  62.94,26.64 270 top
C23  32.46,55.73 270 top
C24  32.08,42.04 270 top
C25  32.26,48.01 270 top
C26  39.17,48.8 90 top
C27  79.43,54.76 270 top
C48  49.99,73.61 0 top
CD1  32.41,18.67 0 top
D1  47.06,60.67 270 top
D2  72.53,63.85 180 top
ESP-12  61.98,24.89 180 top
ESP-PWR  55.12,38.35 0 top
FTDI1  60.2,27.18 180 top
FTDI/UART  95.17,35.59 180 top
GPIO2  33.21,3.81 0 top
I1  52.76,67.91 0 top
I/O  69.78,46.33 270 top
IO1  66.8,14.99 90 top
ISP  94.3,42.93 90 top
J1  4.57,53.59 0 top
J2  4.57,50.04 0 top
J3  4.57,36.07 0 top
J4  4.57,39.62 0 top
LED1  87.16,40.11 270 top
LOGO1  22.6,16.43 0 bottom
MC2  40.53,22.17 90 top
MINI_USB-B  57.66,59.18 0 top
PAD1  84.91,5.82 90 top
PWR  7.6,59.53 0 top
Q1  69.6,38.1 180 top
R1  28.96,33.53 90 top
R2  28.96,30.23 90 top
R3  42.53,21.74 90 top
R4  81,57.69 180 top
R5  38.6,40.81 0 top
R6  41.91,18.87 180 top
R7  65.28,12.7 0 top
R9  41.54,52.23 180 top
R10  83.27,40.16 180 top
R11  45.96,52.23 180 top
R13  38.61,54.86 0 top
R14  28.96,47.24 90 top
R15  28.96,44.2 90 top
R16  77.19,57.68 90 top
R17  42.16,10.92 0 top
R18  42.16,12.95 180 top
R19  69.34,11.68 90 top
R24  79.5,22.73 180 top
R32  86.5,64.89 180 top
REF_SEL_A  40.47,45.01 180 top
REF_SEL_B  33.65,59.46 0 top
REG1117  77.8,68.07 180 top
RF  90.93,23.16 270 top
RF-PWR  56.64,34.54 0 top
S1  32.44,13.97 270 top
S3  91.31,55.88 90 top
SHUNTMON-A  34.8,51.82 0 top
SHUNTMON-B  34.8,37.85 0 top
T1  21.84,51.82 270 top
T2  21.84,37.85 270 top
T3  7.62,25.91 180 top
TL2575HV  36.19,69.74 90 top
U1_TQFP  79.88,47.24 45 top
U$2  19.71,8.66 180 top

### Tracks (layer width: path | path; a pad name or v marks a point on that pad's centre or on a via)
3.3V  (via drill 0.5)
  Top 0.254: 85.03,49.58 85.03,49.56 | U1_TQFP.4 75.54,43.46 C7.1 77.07,42.73 U1_TQFP.6 75.99,41.66 v61.72,41.66 | 81.88,73.51 C13.1
  Top 0.406: 86.77,49.58 85.03,49.58 | 85.03,49.56 U1_TQFP.18 | 86.77,49.58 86.77,47.08 90.93,42.93 ISP.2 | 77.76,71.22 REG1117.2 77.78,73.49 C18.1 81.88,73.51 | 82.04,73.52 C13.1 82.17,73.46 82.17,71.63 85.65,68.14 R32.2 85.65,60.91 86.87,59.69 88.65,59.69 91.19,57.15 91.19,54 86.77,49.58 | v69.09,59.69 74.68,59.69 77.72,62.74 77.72,64.84 REG1117.4 | v58.42,49.02 v58.42,41.66 58.42,40.89 ESP-PWR.2 RF-PWR.1
  Bottom 0.254: v61.72,41.66 v58.42,41.66
  Bottom 0.406: v58.42,49.02 v69.09,59.69 69.47,59.69
3.3V-ESP
  Top 0.254: R7.2 66.13,12.53 R19.2 69.34,17.53 | R6.2 40.89,19.04 34.81,19.04 32.35,21.5 | 69.34,17.53 69.34,20.09 66.57,22.86 64.26,22.86 | IO1.2 69.34,17.53
  Top 0.406: 64.26,25.91 64.26,28.19 62.99,29.46 58.42,29.46 54.36,33.53 ESP-PWR.1 47.29,31.28 38.65,31.28 37.34,29.97 37.34,26.49 32.35,21.5 27.35,16.51 20.3,16.51 U$2.P$4 | 64.26,25.91 64.26,22.86 62.01,22.86 ESP-12.16 | C22.2 64.15,25.8 64.26,25.91
3.3V-RF
  Top 0.406: RF.VDD 86.93,18.22 86.87,18.29 78.65,18.29 R24.2 C2.1 76.37,30.73 61.21,30.73 RF-PWR.2
4.7V  (via drill 0.5, 1.1)
  Top 0.254: R9.2 40.46,52.27 v37.53,50.99
  Top 0.406: D2.C 73.96,63.85 | 72.39,71.06 C1.1 72.52,71.22 | 68.07,62.48 v65.28,59.69 | v57.91,50.42 58.67,50.42 60.71,48.39 v60.71,34.8 63.25,32.26 82.04,32.26 83.31,33.53 87.53,33.53 FTDI/UART.VCC | v49.78,48.26 39.37,37.85 v39.37,37.59 39.37,36.06 C9.1 34.47,34.08 SHUNTMON-B.2 | 41.06,48.17 C26.1 39.15,48.01 v34.54,48.01 34.47,48.08 SHUNTMON-A.2 | 41.06,48.17 41.15,48.17 v41.78,48.26 41.06,48.17
  Top 0.61: v72.39,74.68 72.39,71.06 | 55.56,62.48 68.07,62.48 73.78,62.48 D2.C 73.78,71.22 | 55.56,62.48 54.36,62.48 48.01,56.13 | 48.01,56.13 v41.05,55.96 | 73.78,71.22 REG1117.3 | 73.78,71.22 72.52,71.22 | 55.56,58.08 55.56,62.48 | MINI_USB-B.VBUS 56.06,56.13 48.01,56.13
  Bottom 0.406: v41.05,55.96 41.15,54.61 v37.53,50.99 v34.54,48.01 | v65.28,59.69 57.91,52.32 v57.91,50.42 | v49.78,48.26 v41.78,48.26 | FTDI1.4 52.58,30.23 56.13,30.23 v60.71,34.8
5.0V  (via drill 1.1)
  Top 0.61: D2.A 55.76,63.85 I1.P$2
  Top 1.016: TL2575HV.4 49.14,71.44 | 49.14,71.44 C48.1 | 55.76,71.44 I1.P$2 55.5,68.17 C3.1 | 55.76,71.44 49.14,71.44 | v58.42,74.68 58.42,71.44 55.76,71.44
ADC0
  Top 0.203: U1_TQFP.23 81.5,51.66 81.48,51.66
  Top 0.254: R4.1 81.85,54.85 C5.2 | U1_TQFP.23 82.1,52.29 C5.2 | 82.04,54.84 C5.2
ADC1
  Top 0.254: R16.1 77.19,56.15 C27.2 79.76,53.44 U1_TQFP.24
ADC2
  Top 0.254: U1_TQFP.25 75.97,55.12 70.74,55.12 69.42,53.8 ANA.1
ADC3
  Top 0.254: ANA.2 76.36,53.59 U1_TQFP.26
ADC4-VSENSEA  (via drill 0.5)
  Top 0.254: R2.2 28.96,32 | R1.1 28.96,32 | 28.96,32 37.85,32 57.4,51.56 69.72,51.56 v69.94,51.38 | v76.45,52.32 76.5,52.32 U1_TQFP.27
  Bottom 0.254: 76.56,52.32 v76.45,52.32 74.68,52.32 73.73,51.38 v69.94,51.38
ADC5-VSENSEB  (via drill 0.5)
  Top 0.254: R14.1 R15.2 | R15.2 28.96,44.96 | v51.31,46.74 56.9,52.32 75.37,52.32 U1_TQFP.28 | v33.78,46.74 32.09,45.05 R15.2
  Bottom 0.254: v33.78,46.74 v51.31,46.74
ADCSHUNT-A
  Top 0.254: R5.2 52.77,54.13 65.05,54.13 68.58,57.66 80.12,57.66 R4.2
ADCSHUNT-B
  Top 0.254: R16.2 77.08,58.42 68.33,58.42 64.77,54.86 R13.2
CH_PD
  Top 0.254: ESP-12.11 61.98,12.7 R7.1
D0/RX  (via drill 0.5)
  Top 0.254: v47.5,36.32 v54.86,43.69 | U1_TQFP.30 76,49.48 75.18,50.29 68.71,50.29 v68.58,50.42 | v32,15.24 S1.1
  Bottom 0.254: v47.5,36.32 32,20.83 v32,15.24 | v54.86,43.69 61.85,50.67 68.2,50.67 68.45,50.42 v68.58,50.42 70.87,48.01 72.9,48.01 82.55,38.35 87.58,38.35 FTDI/UART.TXO
D1/TX  (via drill 0.5)
  Top 0.254: v47.5,34.8 v56.39,43.69 | v67.69,49.28 v72.14,49.28 74.93,49.28 75.34,48.87 U1_TQFP.31 | v30.1,12.7 S1.2
  Bottom 0.254: v47.5,34.8 34.29,21.59 34.29,14.99 32,12.7 v30.1,12.7 | v56.39,43.69 62.1,49.28 v67.69,49.28 | FTDI/UART.RXI 90.12,38.86 82.8,38.86 72.14,49.53 v72.14,49.28
D2  (via drill 0.5)
  Top 0.254: RF.IRQ 94.93,32.51 v93.98,33.53 | v72.49,47.14 73.7,48.3 U1_TQFP.32
  Bottom 0.254: v72.49,47.14 81.03,38.61 81.03,33.53 v93.98,33.53
D3
  Top 0.254: U1_TQFP.1 70.1,46.19 I/O.1
D4
  Top 0.254: U1_TQFP.2 74.52,44.7 70.87,44.7 I/O.2
D6
  Top 0.254: U1_TQFP.10 82.41,41.63 R10.2
D8  (via drill 0.5)
  Top 0.254: S3.4 v89.66,54.61 | U1_TQFP.12 82.63,43.88 v83.59,42.93
  Bottom 0.254: v89.66,54.61 89.66,45.47 86.11,41.91 84.61,41.91 v83.59,42.93
D9  (via drill 0.5)
  Top 0.254: S3.3 86.72,57.18 v88.7,57.18 | U1_TQFP.13 84.72,42.98 v85.72,42.98
  Bottom 0.254: v85.72,42.98 88.7,45.95 v88.7,57.18
D10  (via drill 0.5)
  Top 0.254: RF.SEL 96.93,19.91 82.04,19.91 82.04,22.61 | U1_TQFP.14 84.78,44.04 v84.78,44.02 | v91.69,39.12 79.76,39.12 v79.5,38.86 | v79.5,30.99 82.04,30.99 82.04,22.61 | R24.1 80.35,22.61 82.04,22.61
  Bottom 0.254: v84.78,44.02 84.71,43.94 83.06,43.94 82.55,43.43 82.55,42.16 83.82,40.89 88.14,40.89 89.41,39.62 91.19,39.62 v91.69,39.12 | v79.5,38.86 v79.5,30.99
D11/MOSI  (via drill 0.5)
  Top 0.254: ISP.4 91.76,44.18 95.76,44.18 95.76,40.64 94.74,40.64 | U1_TQFP.15 84.42,45.62 89.41,40.64 94.74,40.64 | RF.SDI 92.96,14.89 v92.96,18.8 | 94.74,40.64 94.74,38.86 96.77,36.83 96.77,35.05 95.5,33.78 v95.5,33.53
  Bottom 0.254: v92.96,18.8 96.52,22.35 96.52,28.7 95.5,29.72 v95.5,33.53
D12/MISO  (via drill 0.5)
  Top 0.254: U1_TQFP.16 89.68,41.4 94.31,41.4 94.3,43.24 ISP.1 | RF.SDO 97.79,32.23 97.79,38.86 v97.14,40.15
  Bottom 0.254: v97.14,40.15 94.3,42.86 ISP.1
D13/SCK  (via drill 0.5)
  Top 0.254: v85.7,47.51 84.92,48.3 U1_TQFP.17 | v87.89,47.51 88,47.25 88.48,46.75 93.56,46.74 ISP.3 96.27,45.47 96.27,38.86 97.28,37.85 97.28,34.04 v96.77,33.53 | RF.SCK 94.93,18.73 v95,18.8
  Bottom 0.254: v85.7,47.51 v87.89,47.51 | v95,18.8 97.28,21.08 97.28,29.21 96.77,29.72 v96.77,33.53
DIG1
  Top 0.254: RF.ANT 84.91,14.86
  Top 0.406: 84.94,14.85 RF.ANT | C20.1 82.65,12.15 C19.1
  Top 1.016: C19.1 84.94,14.85
ESPRX
  Top 0.254: R17.2 42.79,10.89 ESP-12.7 | S1.3 36.87,12.15 39.37,9.65 41.74,9.65 R17.2 | R17.2 R18.1
ESPTX  (via drill 0.5)
  Top 0.254: v48.77,8.89 ESP-12.8 36.83,8.89 35.05,10.67 35.05,13.21 37.08,15.24 S1.4
  Bottom 0.254: v48.77,8.89 55.12,8.89 55.12,22.35 57.66,22.35 FTDI1.2
GND  (via drill 0.5, 3.2 pad 5.59)
  Top 0.254: S3.1 S3.2 | 14.38,4.47 14.48,4.57 14.35,4.7 | ESP-12.1 46.06,22.61
  Top 0.406: U$2.GND2 | U$2.P$6 22.48,14.39 | 25.86,13.97 25.91,13.97 25.96,14.02
  other vias: 10.08,67.21 72.06,42.75 69.71,33.79 92.07,67.23 52.47,73.15 93.97,61.04 10.08,9.2 92.07,9.2 33.51,32.85 15.17,56.58 30.55,43.87 37.41,49.17 84.53,56.66 80.87,56.21 70.94,68.18 30.66,48.96 34.06,57.24 37.39,37.35 27.29,7.76 47.77,22.53 80.62,25.78 86.46,27.56 79.91,47.25 82.91,14.49 87.49,12.2 82.53,9.54 88.76,17.54 85.2,17.28 51.93,11.44 22.49,12.89 58.53,38.11 53.96,46.49 53.2,51.07 42.93,58.34 49.18,59.12 74.91,56.54 67.59,69.65 47.7,69.7 28.88,71.47 20.04,73.36 24.49,73.2 15.81,45.01 30.48,29.4 34.01,43.3 87.23,9.66 87.23,7.12 82.41,6.87 80.01,69.06 85.42,74.4 20.81,3.54 62.53,35.46 47.92,60.72 44.98,24.32 25.51,11.7 61.56,25.25 15.12,11.62 38.98,14.03 96.51,51.39 94.84,27.82 27.64,55.62 23.83,43.43 43.83,23.8 37.18,20.93 37.71,22.7 33.04,10.88 34.57,8.11 47.67,7.68 27.25,3.88 37.11,3.79 42.48,49.71 37.08,38.53 46.15,60.8 74.41,74.54 81.69,69.72 67.48,66.58 72.22,67.52 52.32,74.58 29.11,67.83 28.79,69.71 43.59,74.69 45.62,74.69 69.71,35.06 24.1,15.62 22.27,68.6 81.21,68.52 82.86,61.28 80.27,60.98 37.02,53.19 45.69,49.78 49.25,52.95 31.27,60.79
  pour Bottom (isolate 0.127): 6.86,76.2 6.86,63.5 0.25,63.5 0.25,12.95 6.86,12.95 6.86,2.54 95.76,2.54 95.76,12.95 98.81,12.95 98.81,63.5 95.76,63.5 95.76,76.2
  pour Top (isolate 0.127): 6.86,76.2 6.86,63.5 0.25,63.5 0.25,12.95 6.86,12.95 6.86,2.54 95.76,2.54 95.76,12.95 98.81,12.95 98.81,63.5 95.76,63.5 95.76,76.2
GPIO0
  Top 0.254: MC2.P$3 39.77,25.15 | 39.77,25.15 MC2.P$4 | ESP-12.4 47.63,16.89 49.28,18.54 49.28,22.61 46.74,25.15 39.77,25.15
GPIO2  (via drill 0.5)
  Top 0.254: ESP-12.3 42.78,18.89 R6.1 42.76,16.68 v42.93,16.51
  Bottom 0.254: v42.93,16.51 47.5,16.51 50.04,13.97 50.04,12.45 45.6,8.01 37.4,8.01 GPIO2.MP
GPIO4
  Top 0.254: CD1.2 34.69,17.14 39.12,17.14 41.15,15.11 42.98,15.11 45.2,12.89 ESP-12.6
GPIO12
  Top 0.254: ESP-12.14 58.17,18.89 58.17,6.6 23.59,6.6 U$2.P$7
GPIO13  (via drill 0.5)
  Top 0.254: v56.39,20.83 61.98,20.83 | U$2.P$3 19.19,5.59 38.86,5.59 v39.37,5.08
  Top 0.406: 61.98,20.83 ESP-12.15
  Bottom 0.254: v56.39,20.83 56.39,5.08 v39.37,5.08
GPIO14
  Top 0.254: ESP-12.13 58.67,16.89 58.67,6.1 21.39,6.1 U$2.P$5
GPIO15  (via drill 0.5)
  Top 0.254: ESP-12.2 R3.1 47.88,20.89 v47.88,20.7 | v18.03,9.65 18.09,9.65 U$2.P$2
  Bottom 0.254: v47.88,20.7 45.35,20.7 41.25,16.6 41.25,9.65 v18.03,9.65
GPIO16
  Top 0.254: IO1.1 66.71,14.89 ESP-12.12
IND
  Top 1.016: TL2575HV.2 49.63,68.04 | 49.63,68.04 I1.P$1 | 49.63,68.04 49.63,65.1 D1.P$1
LOAD-NEG-A
  Top 0.406: 32.12,39.62 33.82,39.62 SHUNTMON-B.8 | C24.2 32.12,41.19 32.12,39.62 | J4.1 J4.2 J4.3 9.68,39.6 T2.1 21.87,39.62 32.12,39.62
LOAD-NEG-B
  Top 0.406: 32.51,53.59 33.82,53.59 SHUNTMON-A.8 | C23.2 32.51,54.88 32.51,53.59 | J1.1 J1.2 J1.3 9.68,53.57 T1.1 21.87,53.59 32.51,53.59
N$1
  Top 0.254: C4.1 63.65,38.1 Q1.2 65.28,38.1 66.55,39.62 75.09,39.62 78.23,42.77 78.23,42.79 U1_TQFP.7
  Top 0.406: Q1.2
N$2
  Top 0.406: 77.72,64.9 77.8,64.9 77.8,71.15
N$3
  Top 1.016: C19.2 ANT1.1
N$4
  Top 0.254: SHUNTMON-A.5 35.77,54.86 R13.1
N$5
  Top 0.254: 94.74,1.02 7.62,1.02 7.62,1.52 84.91,1.52 84.91,5.33
  Top 0.406: 84.91,5.33 PAD1.1
N$6
  Top 0.254: SHUNTMON-B.5 35.81,40.81 R5.1
N$9
  Top 0.254: 74.64,37.88 75.55,37.88 | 75.55,37.88 C11.1 | U1_TQFP.8 75.55,38.95 75.55,37.88
  Top 0.406: 74.64,37.88 Q1.1
N$10  (via drill 0.5)
  Top 0.254: v16.76,8.38 14.52,8.38 U$2.CD1 | CD1.1 31.64,18.41 31.64,17.52 33.27,16.14 33.27,13.97 30.48,11.43 27.94,11.43 v24.89,8.38
  Bottom 0.254: v24.89,8.38 v16.76,8.38
N$13
  Top 0.406: 79.25,64.9 85.59,64.9
N$20
  Top 0.203: U1_TQFP.20 83.14,50 83.16,49.94
  Top 0.254: U1_TQFP.20 84.42,51.22 C8.1
N$30  (via drill 0.5)
  Top 0.254: v66.04,6.6 66.04,8.89 C21.2
  Bottom 0.254: FTDI1.1 60.2,6.6 v66.04,6.6
N$36  (via drill 0.5)
  Top 0.254: v39.97,10.94 R17.1
  Bottom 0.254: FTDI1.3 55.12,24.13 47.24,24.13 39.99,16.68 v39.97,10.94
N$41
  Top 0.254: R10.1 84.42,40.11 LED1.A
PWR_IN
  Top 1.016: 44.27,66.33 TL2575HV.1 44.01,66.33 44.01,62.66 43.94,62.66 | PWR.2 13.27,62.66 21.84,62.66 21.93,62.66 | 43.94,62.66 42.29,62.66 41.9,62.27 | C16.1 41.9,62.27 | C17.1 43.97,62.63 43.94,62.66 | 21.93,62.66 C10.1 | 41.9,62.27 41.9,62.66 21.93,62.66
REF_A_INPUT
  Top 0.254: REF_SEL_A.2 37.93,44.79 35.05,41.91 | 35.05,41.91 35.05,40.07 SHUNTMON-B.6 | SHUNTMON-B.7 34.47,41.91 35.05,41.91
REF_B_INPUT
  Top 0.254: 36.2,57.28 35.05,56.13 | 35.05,56.13 35.05,54.04 SHUNTMON-A.6 | REF_SEL_B.2 36.2,57.28 | 36.2,57.28 | SHUNTMON-A.7 34.47,56.13 35.05,56.13
REF_INPUT  (via drill 0.5)
  Top 0.254: R11.2 42.42,52.24 R9.1 43.69,52.23 | 43.69,52.23 v43.69,53.72 | 43.69,52.23 43.69,48.26 40.47,45.04 REF_SEL_A.1
  Bottom 0.254: v43.69,53.72 43.69,55.63 40.13,59.18 39.01,59.18 REF_SEL_B.3
RESET1
  Top 0.254: ISP.5 93.47,48.83 93.47,59.44 91.02,61.89 C14.2
  Bottom 0.254: FTDI/UART.DTR 93.03,37.73 93.03,46.73 ISP.5
RESET2  (via drill 0.5)
  Top 0.254: R32.1 87.38,62.07 v87.38,61.98 C14.1 | v75.05,51.25 75.16,51.4 U1_TQFP.29
  Bottom 0.254: v87.38,61.98 87.38,61.17 77.27,51.06 75.77,51.06 v75.05,51.25
RESTESP
  Top 0.254: ESP-12.9 C21.1 64.43,10.83 R19.1
SOURCE-POS-A
  Top 0.254: R1.2 28.96,36.07
  Top 0.406: 32,36.07 28.96,36.07 28.96,36.1 T2.2 9.68,36.1 J3.3 J3.2 5.08,36.07 4.83,35.81 J3.1 | 32,36.07 33.82,36.07 SHUNTMON-B.1 | C6.1 32,36.07
  Bottom 1.016: 22.86,36.07 21.87,36.07 T2.2 20.29,36.1 11.68,44.7 11.68,54.61 7.6,58.7 PWR.1
SOURCE-POS-B
  Top 0.254: R14.2 28.96,50.04
  Top 0.406: 32.26,50.04 28.96,50.04 28.96,50.07 T1.2 9.68,50.07 J2.3 J2.2 J2.1 | 32.26,50.04 33.69,50.04 33.82,49.91 SHUNTMON-A.1 | C25.1 32.26,50.04
  Bottom 1.016: PWR.3 12.68,57.17 19.81,50.04 21.82,50.04 T1.2

### Text on the board
tPlace: GND | RST | VSENSE-B | D3 | D11 | D13 | D4 | 3.3V | D12 | VSENSE-A | MicroSD
bPlace: emonDC | wireless energy monitoring node | Technology that helps us live within ecological limits | Designed in North Wales UK by Megni | OpenEnergyMonitor.org | Designed in | Lead free PCB - RoHS components | Node: | North Wales | Made in UK | Open-Hardware | Format MicroSD / card to FAT32. / Place blank 'datalog.txt' / file there.
tNames: I1 | 470uF | 100uF | 16V | 80V | 330uH | D1 | A | B | USB_PWR | ADC3 | ADC2 | B | LMP | BI | UNI | 16MHz | A | LMP | BOOT- / LOADER / MODE | FACTORY / RESET | GND / (0V) | TX | RX
tSilk: 5.0V | 4.7V | 4.7V | D9 | 2 / / 1 | D8 | GND | 5V | Tx | Rx | RST | UART/FTDI | GND | 5V | Tx | Rx | RST | Wireless Energy / Monitoring Node | emonDC | v1.0 July 2017 by DB | based on emonTx / v3.4 by GH and TL
_tsilk: Designed in | North Wales | Made in UK
_bsilk: SMT V0.6 rev3 | emonTx | wireless energy monitoring node | SMT V0.6 rev3 | emonTx | SMT V0.6 rev3 | emonTx | Technology that helps us live within ecological limits | wireless energy monitoring node | wireless energy monitoring node | Designed in North Wales UK by Glyn Hudson & Trystan Lea | Technology that helps us live within ecological limits | Technology that helps us live within ecological limits | Designed in North Wales UK by Glyn Hudson & Trystan Lea | 165mm ant | 433Mhz | Designed in North Wales UK by Glyn Hudson & Trystan Lea | 165mm ant | 165mm ant | 433Mhz | 433Mhz | 868Mhz | 82mm ant | 82mm ant | 82mm ant | 868Mhz | 868Mhz | 78mm ant | 915Mhz | 78mm ant | 915Mhz | 78mm ant | 915Mhz | 165mm ant | 433Mhz | 82mm ant | 868Mhz | 78mm ant | 915Mhz